# EAGLE board Schmatic (EAGLE 9.5.0)
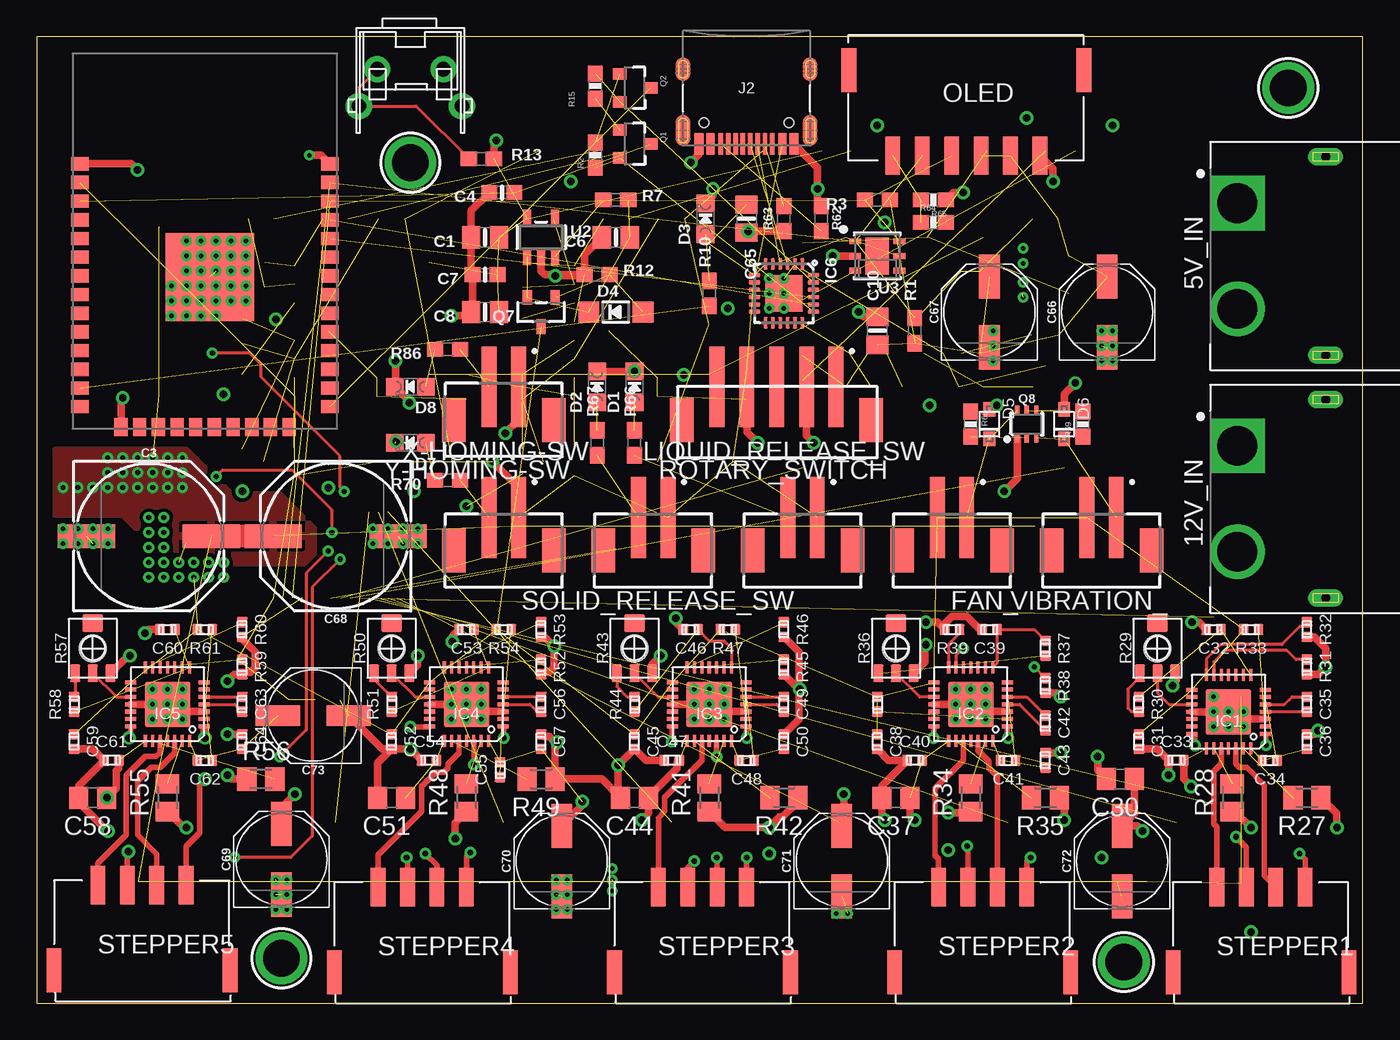
[diagram p2: board, top side]
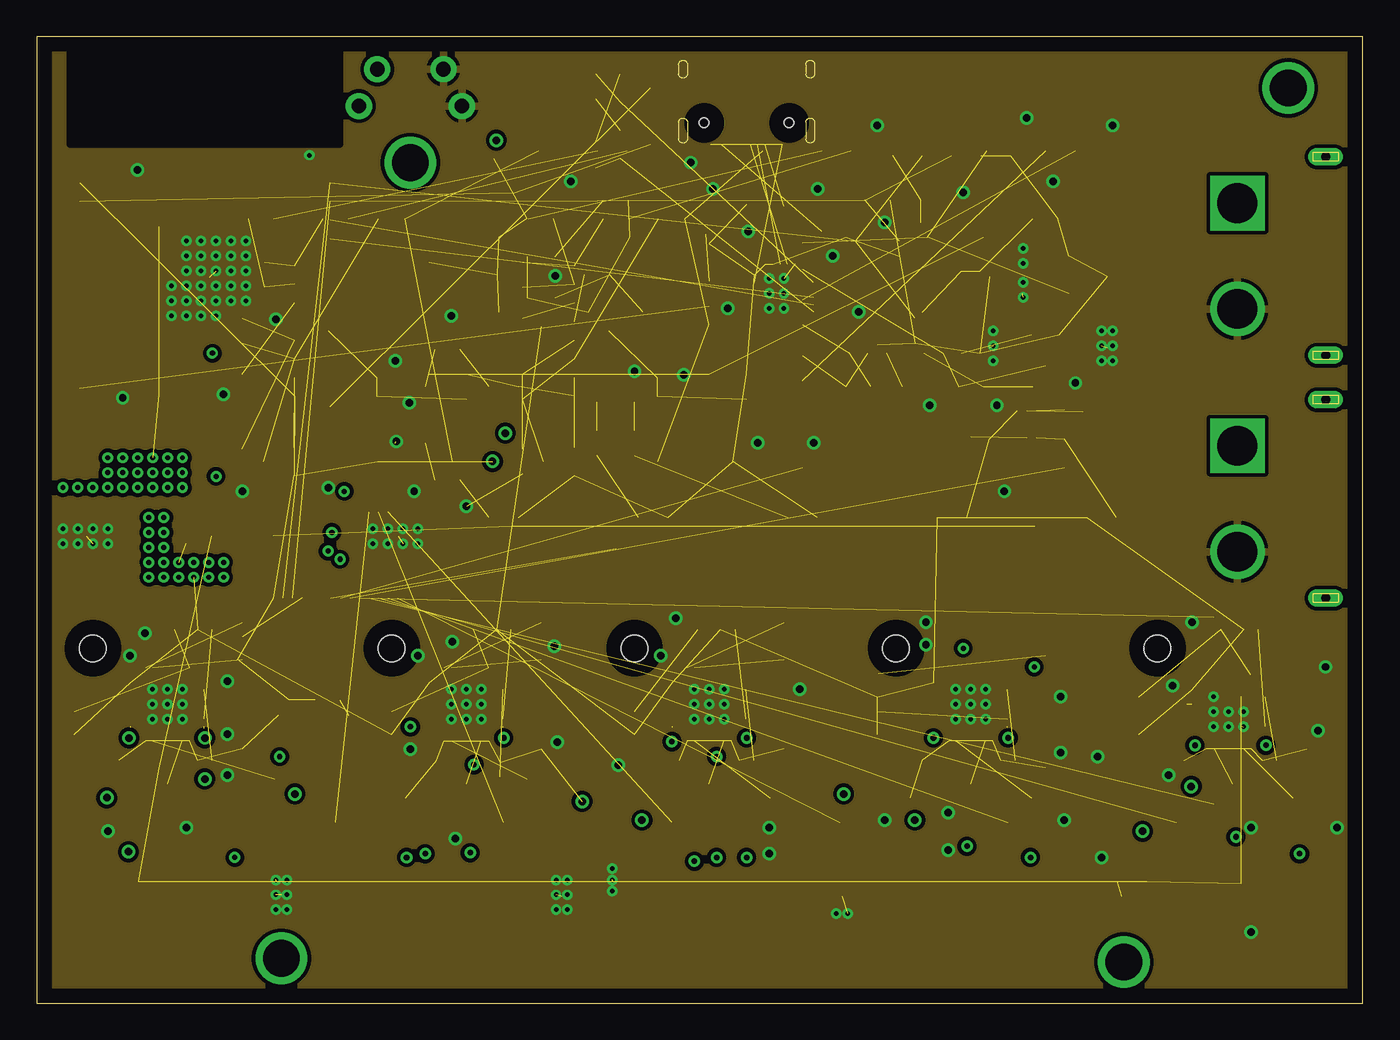
[diagram p3: board, inner layer GND]
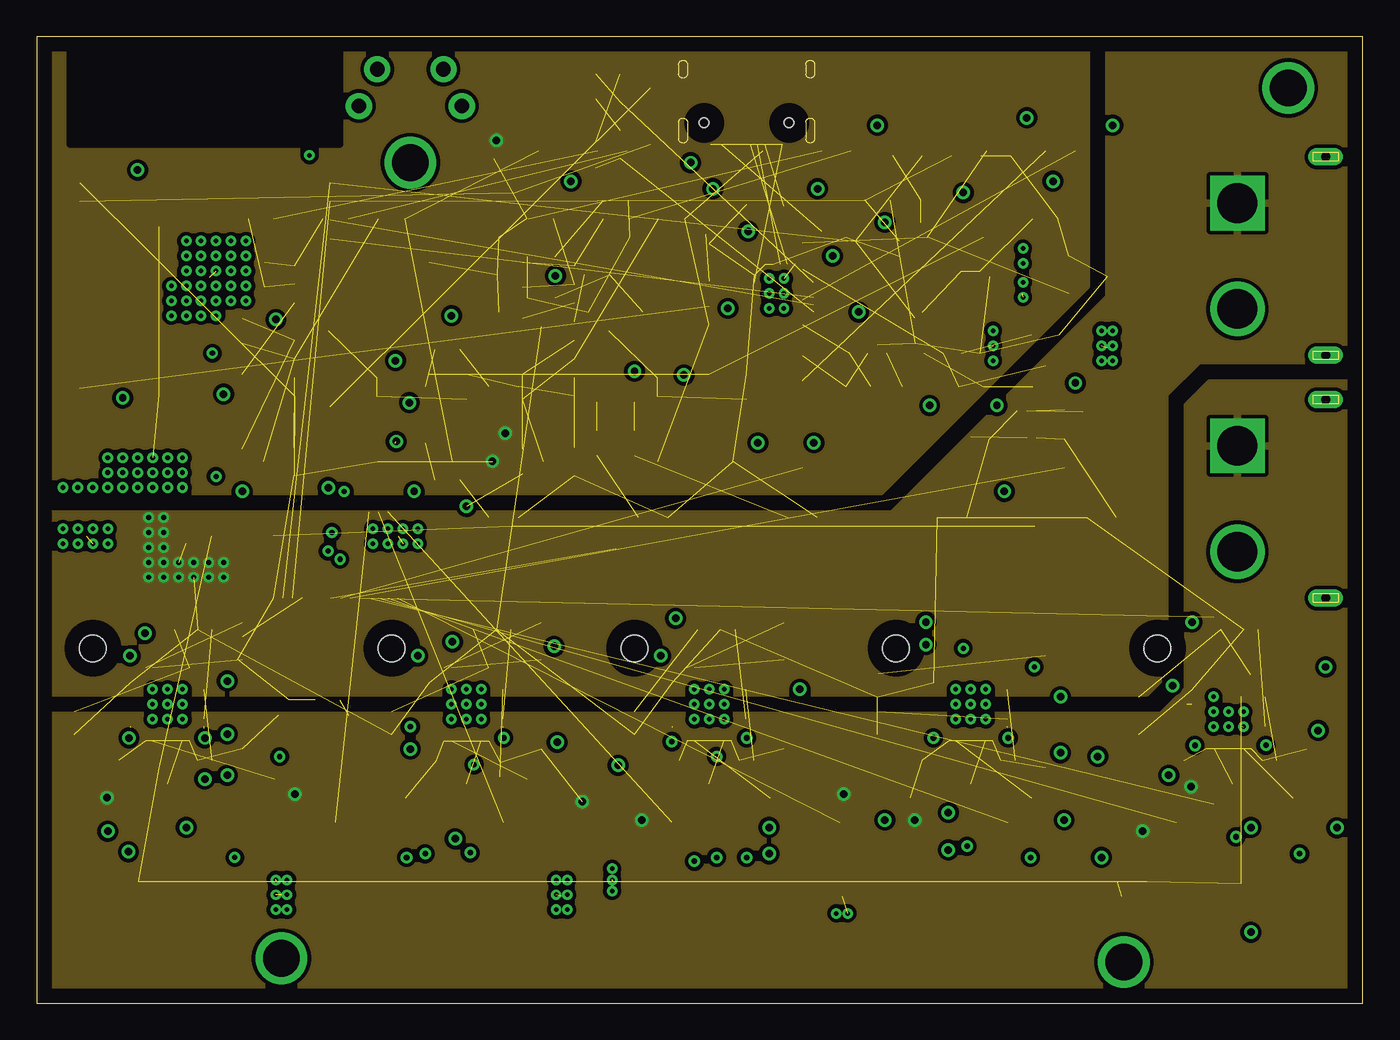
[diagram p4: board, inner layer Vref]
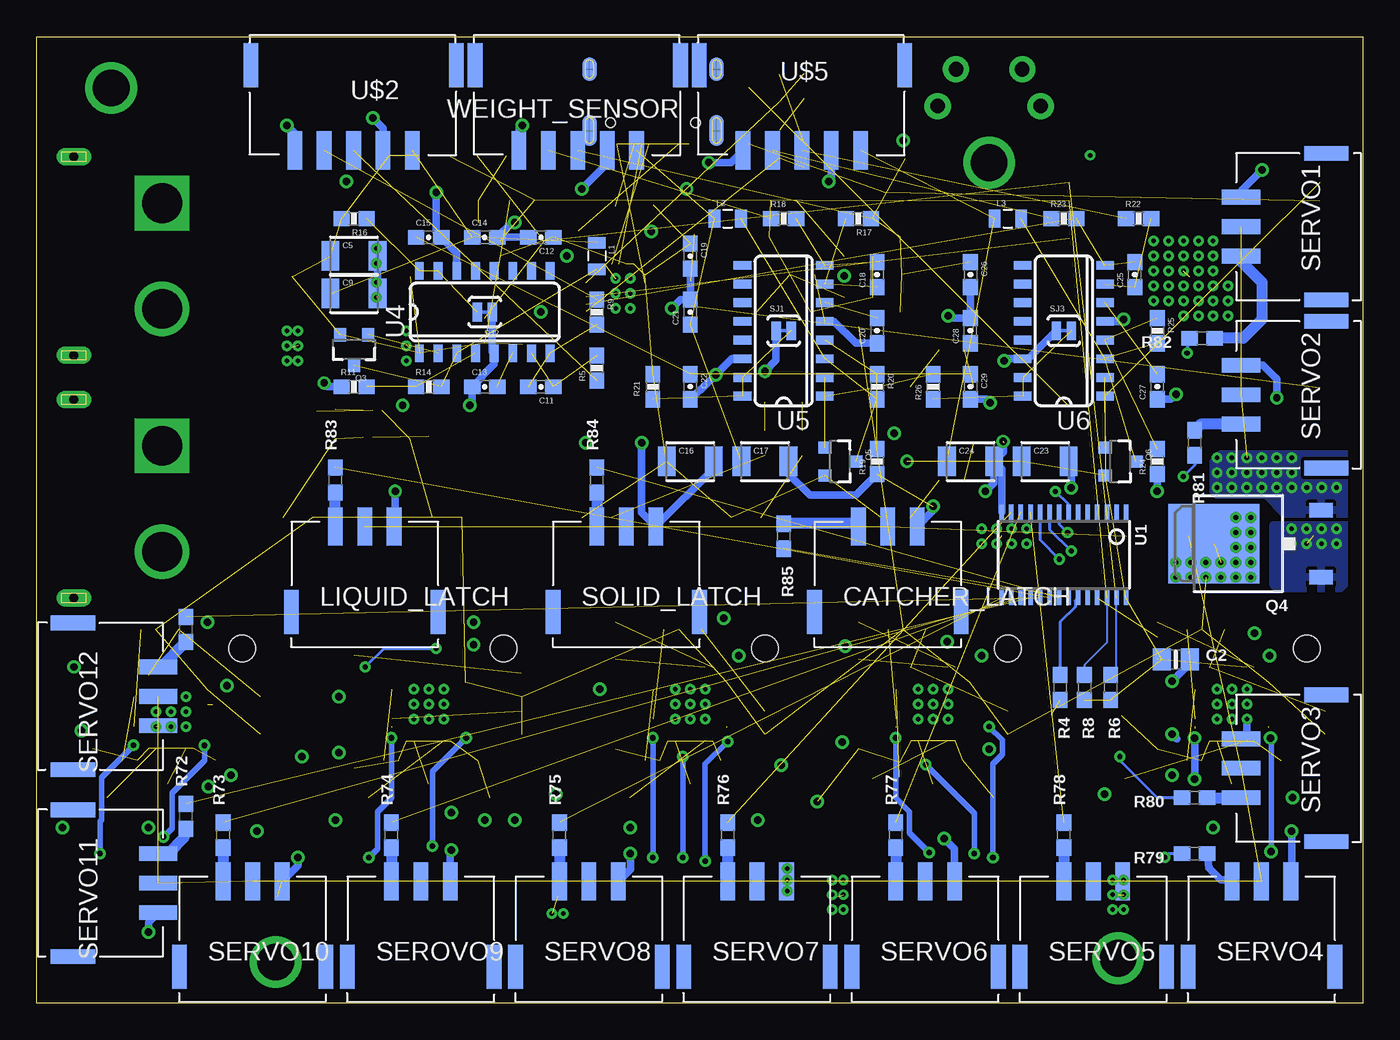
[diagram p5: board, bottom side, seen from below]

Size 90.15 x 65.71 mm. Coordinates in mm from the lower left corner, seen from the top.
Outline: 0,0 90.15,0 90.15,65.71 0,65.71 0,0
Copper layers (1+2*15+16): Top 0.035mm / dielectric 1.5mm / GND 0.035mm / dielectric 0.15mm / Vref 0.035mm / dielectric 0.2mm / Bottom 0.035mm
Design rules "default *": minimum track width 6mil, minimum drill 0.35mm, track to track 6mil, track to pad 6mil, pad to pad 6mil, via to via 6mil, smd to smd 6mil, copper to edge 40mil, drill to drill 6mil, minimum pad ring 10mil, minimum via ring 8mil, stop-mask expansion 4mil, vias tented up to drill 0mil, thermal gap 10mil
Net classes: 0 default: width 0.203 mm, drill 0.203 mm, clearance 0.203 mm; 1 sig: width 0.305 mm, drill 0.305 mm, clearance 0.254 mm; 2 Power: width 0.508 mm, drill 0.508 mm, clearance 0.254 mm; 3 HighSpeedSig: width 0.152 mm, drill 0.152 mm, clearance 0.254 mm; 4 StepperOut: width 0.381 mm, drill 0.381 mm, clearance 0.254 mm; 5 LowPower: width 0.305 mm, drill 0.305 mm, clearance 0.254 mm

## Footprints (pad centres in the part's own frame; a part is rotated, then mirrored left to right if it is on the bottom)
AMASS_XT60PW-M = drill 2.7 square: 1 -3.6,-6 | drill 2.7: 2 3.6,-6 | drill 0.6 pad 1.2 long: S1 -6.75,0; S2 6.75,0
0805-NO = smd 1.24 x 1.5: 1 -0.95,0; 2 0.95,0
PANASONIC_G = smd 3.9 x 1.6: + 4.25,0; - -4.25,0
0603-NO = smd 1.075 x 1: 1 -0.85,0; 2 0.85,0
1210 = smd 1.2 x 2: 1 -1.6,0; 2 1.6,0
0603-CAP = smd 1.1 x 1: 1 -0.85,0; 2 0.85,0
C0805 = smd 1.3 x 1.5: 1 -0.95,0; 2 0.95,0
C0402 = smd 0.75 x 0.7: 1 0,0.5; 2 0,-0.5
PANASONIC_D = smd 3 x 1.4: + 2.4,0; - -2.4,0
S3B-PH-SM4_TB = smd 1 x 2.6: 1 3.81,8.28; 2 5.81,8.28; 3 7.81,8.28 | smd 1 x 3: GND 0.826,2.48; GND2 10.794,2.48
CHIPLED_0805_NOOUTLINE = smd 1.2 x 1.2: A 0,-1.05; C 0,1.05
SOD-123 = smd 1.4 x 1.4: A 1.85,0; C -1.85,0
SOD-323F = smd 1 x 0.8: A -1,0; C 1,0
JST_B2B-PH-SM4-TB(LF)(SN) = smd 1 x 5.5: 1 -1,0; 2 1,0 | smd 1.6 x 3: 3 -3.4,2.25; 4 3.4,2.25
QFN28-PAD = smd 0.8 x 0.26: 1 -2.5,1.5; 2 -2.5,1; 3 -2.5,0.5; 4 -2.5,0; 5 -2.5,-0.5; 6 -2.5,-1; 7 -2.5,-1.5; 15 2.5,-1.5; 16 2.5,-1; 17 2.5,-0.5; 18 2.5,0; 19 2.5,0.5; 20 2.5,1; 21 2.5,1.5 | smd 0.26 x 0.8: 8 -1.5,-2.5; 9 -1,-2.5; 10 -0.5,-2.5; 11 0,-2.5; 12 0.5,-2.5; 13 1,-2.5; 14 1.5,-2.5; 22 1.5,2.5; 23 1,2.5; 24 0.5,2.5; 25 0,2.5; 26 -0.5,2.5; 27 -1,2.5; 28 -1.5,2.5 | smd 3.1 x 3.1: TP 0,0
QFN24_4MM_SMSC = smd 0.8 x 0.28: 1 -2,1.25; 2 -2,0.75; 3 -2,0.25; 4 -2,-0.25; 5 -2,-0.75; 6 -2,-1.25; 13 2,-1.25; 14 2,-0.75; 15 2,-0.25; 16 2,0.25; 17 2,0.75; 18 2,1.25 | smd 0.28 x 0.8: 7 -1.25,-2; 8 -0.75,-2; 9 -0.25,-2; 10 0.25,-2; 11 0.75,-2; 12 1.25,-2; 19 1.25,2; 20 0.75,2; 21 0.25,2; 22 -0.25,2; 23 -0.75,2; 24 -1.25,2 | smd 2.5 x 2.5: THERM 0,0
USB-C-16P = smd 0.3 x 1.45: A5 -1.25,0; A6 -0.25,0; A7 0.25,0; A8 1.25,0; B5 1.75,0; B6 0.75,0; B7 -0.75,0; B8 -1.75,0 | smd 0.6 x 1.45: GND -3.225,0; GND2 3.225,0 | smd 1 x 2.1: SHLD1 -4.32,-0.915; SHLD2 4.32,-0.915 | smd 1 x 2.1 bottom: SHLD3 -4.32,-0.915; SHLD4 4.32,-0.915 | smd 1 x 1.6: SHLD5 -4.32,-5.095; SHLD8 4.32,-5.095 | smd 1 x 1.6 bottom: SHLD6 -4.32,-5.095; SHLD7 4.32,-5.095 | smd 0.55 x 1.45: VBUS1 -2.45,0; VBUS2 2.45,0 | hole 0.65: -2.89,-1.445; 2.89,-1.445
0805 = smd 0.8 x 1.2: 1 -0.9,0; 2 0.9,0
S6B-PH-SM4_TB = smd 1 x 2.6: 1 5.46,9.68; 2 7.46,9.68; 3 9.46,9.68; 4 11.46,9.68; 5 13.46,9.68; 6 15.46,9.68 | smd 1 x 3: GND 2.476,3.88; GND2 18.444,3.88
SOT23-3 = smd 0.8 x 0.9: 1 -0.95,-1; 2 0.95,-1; 3 0,1.1
TO252 = smd 1 x 1.6: 1 -2.28,-4.8; 2 2.28,-4.8 | smd 5.4 x 6.2: 3 0,2.5
SOT23-R = smd 0.635 x 1.016: 1 -0.95,-1; 2 0.95,-1; 3 0,1
SC70-6 = smd 0.3 x 0.66: 1 -0.65,-0.92; 2 0,-0.92; 3 0.65,-0.92; 4 0.65,0.92; 5 0,0.92; 6 -0.65,0.92
0603 = smd 1.1 x 1: 1 -0.85,0; 2 0.85,0
0603-RES = smd 1.1 x 1: 1 -0.85,0; 2 0.85,0
0603-NO@1 = smd 1.1 x 1: 1 -0.85,0; 2 0.85,0
M0805 = smd 1.3 x 1.6: 1 -0.95,0; 2 0.95,0
POT_EVM3R = smd 0.7 x 1.2: 1 -1.2,-1.7; 2 0,-1.7; 3 1.2,-1.7 | smd 1.4 x 1.2: MOUNT 0,1.7 | hole 1.8: 0,0
JST_B5B-PH-SM4-TB = smd 1 x 5.5: 1 4.08,3.81; 2 6.08,3.81; 5 8.112,3.81; 6 10.144,3.81; 7 12.176,3.81 | smd 1.6 x 3: 3 1.68,6.06; 4 14.576,6.06
PAD-JUMPER-2-NC_BY_TRACE_YES_SILK = smd 0.635 x 1.27: 1 -0.508,0; 2 0.508,0
S4B-PH-SM4_TB = smd 1 x 2.6: 1 3.27,7.9; 2 5.27,7.9; 3 7.27,7.9; 4 9.27,7.9 | smd 1 x 3: GND 0.286,2.1; GND2 12.254,2.1
TSSOP28 = smd 0.305 x 0.991: 1 -4.225,-2.918; 2 -3.575,-2.918; 3 -2.925,-2.918; 4 -2.275,-2.918; 5 -1.625,-2.918; 6 -0.975,-2.918; 7 -0.325,-2.918; 8 0.325,-2.918; 9 0.975,-2.918; 10 1.625,-2.918; 11 2.275,-2.918; 12 2.925,-2.918; 13 3.575,-2.918; 14 4.225,-2.918; 15 4.225,2.918; 16 3.575,2.918; 17 2.925,2.918; 18 2.275,2.918; 19 1.625,2.918; 20 0.975,2.918; 21 0.325,2.918; 22 -0.325,2.918; 23 -0.975,2.918; 24 -1.625,2.918; 25 -2.275,2.918; 26 -2.925,2.918; 27 -3.575,2.918; 28 -4.225,2.918
SOT23-5 = smd 0.55 x 1.2: 1 -0.95,-1.3; 2 0,-1.3; 3 0.95,-1.3; 4 0.95,1.3; 5 -0.95,1.3
HTU21DF = smd 0.8 x 0.4: 1 -1.5,1; 2 -1.5,0; 3 -1.5,-1; 4 1.5,-1; 5 1.5,0; 6 1.5,1 | smd 1.6 x 2.5: PAD 0,0
SO16 = smd 0.6 x 1.2: 1 -4.445,-2.8; 2 -3.175,-2.8; 3 -1.905,-2.8; 4 -0.635,-2.8; 5 0.635,-2.8; 6 1.905,-2.8; 7 3.175,-2.8; 8 4.445,-2.8; 9 4.445,2.8; 10 3.175,2.8; 11 1.905,2.8; 12 0.635,2.8; 13 -0.635,2.8; 14 -1.905,2.8; 15 -3.175,2.8; 16 -4.445,2.8
S5B-PH-SM4_TB = smd 1 x 2.6: 1 4.92,9.33; 2 6.92,9.33; 3 8.92,9.33; 4 10.92,9.33; 5 12.92,9.33 | smd 1 x 3: GND 1.936,3.53; GND2 15.904,3.53
MOUNTINGHOLE_2.5_PLATED = drill 2.5 pad 3.2: P$1 0,0
RIGHT_ANGLE_TACTILE_SWITCH = drill 1 pad 1.778: B_L -2.25,0; B_R 2.25,0; T_L -3.5,2.5; T_R 3.5,2.5
WROOM32_SKINNY = smd 1.2 x 0.9: 1 -8.5,5; 2 -8.5,3.73; 3 -8.5,2.46; 4 -8.5,1.19; 5 -8.5,-0.08; 6 -8.5,-1.35; 7 -8.5,-2.62; 8 -8.5,-3.89; 9 -8.5,-5.16; 10 -8.5,-6.43; 11 -8.5,-7.7; 12 -8.5,-8.97; 13 -8.5,-10.24; 14 -8.5,-11.51; 25 8.5,-11.51; 26 8.5,-10.24; 27 8.5,-8.97; 28 8.5,-7.7; 29 8.5,-6.43; 30 8.5,-5.16; 31 8.5,-3.89; 32 8.5,-2.62; 33 8.5,-1.35; 34 8.5,-0.08; 35 8.5,1.19; 36 8.5,2.46; 37 8.5,3.73; 38 8.5,5 | smd 0.9 x 1.2: 15 -5.7,-12.9; 16 -4.43,-12.9; 17 -3.16,-12.9; 18 -1.89,-12.9; 19 -0.62,-12.9; 20 0.65,-12.9; 21 1.92,-12.9; 22 3.19,-12.9; 23 4.46,-12.9; 24 5.73,-12.9 | smd 6 x 6: P$1 0.34,-2.7

## Placement (x,y rotation side)
5V_IN  XT60PW-M  [AMASS_XT60PW-M]  87.63,50.8 270 top
12V_IN  XT60PW-M  [AMASS_XT60PW-M]  87.63,34.29 270 top
C1  10uF  [0805-NO]  30.48,52.07 180 top
C2  10uF  [0805-NO]  12.7,23.37 0 bottom
C3  560uF  [PANASONIC_G]  7.62,31.75 0 top
C4  1uF  [0603-NO]  31.62,55.12 180 top
C5  10uF  [1210]  68.58,50.8 0 bottom
C6  10µF  [0805-NO]  39.37,52.07 180 top
C7  1uF  [0603-NO]  30.48,49.53 180 top
C8  10µF  [0805-NO]  30.48,46.99 180 top
C9  10uF  [1210]  68.58,48.26 0 bottom
C10  0.1uF  [0805-NO]  57.15,45.72 90 top
C11  0.1uF  [0603-CAP]  55.88,41.91 180 bottom
C12  0.1uF  [0603-CAP]  55.88,52.07 180 bottom
C13  0.1uF  [0603-CAP]  59.69,41.91 0 bottom
C14  0.1uF  [0603-CAP]  59.69,52.07 0 bottom
C15  0.1uF  [0603-CAP]  63.5,52.07 0 bottom
C16  10uF  [1210]  45.72,36.83 0 bottom
C17  10uF  [1210]  40.64,36.83 0 bottom
C18  0.1uF  [0603-CAP]  33.02,49.53 90 bottom
C19  0.1uF  [0603-CAP]  45.72,50.8 270 bottom
C20  0.1uF  [0603-CAP]  33.02,45.72 90 bottom
C21  0.1uF  [0603-CAP]  45.72,46.99 90 bottom
C22  0.1uF  [0603-CAP]  45.72,41.91 270 bottom
C23  10uF  [1210]  21.59,36.83 0 bottom
C24  10uF  [1210]  26.67,36.83 0 bottom
C25  0.1uF  [0603-CAP]  15.49,49.53 90 bottom
C26  0.1uF  [0603-CAP]  26.67,49.53 270 bottom
C27  0.1uF  [0603-CAP]  13.97,41.91 90 bottom
C28  0.1uF  [0603-CAP]  26.67,45.72 90 bottom
C29  0.1uF  [0603-CAP]  26.67,41.91 270 bottom
C30  1u/50V  [C0805]  73.66,15.24 180 top
C31  100n/50V  [C0402]  74.93,17.78 180 top
C32  4u7/6V3  [C0402]  80.01,25.4 90 top
C33  100n/50V  [C0402]  77.47,16.51 270 top
C34  100n/50V  [C0402]  83.82,16.51 90 top
C35  22n/50V  [C0402]  86.36,20.32 180 top
C36  100n/50V  [C0402]  86.36,17.78 180 top
C37  1u/50V  [C0805]  58.42,13.97 180 top
C38  100n/50V  [C0402]  57.15,17.78 180 top
C39  4u7/6V3  [C0402]  64.77,25.4 90 top
C40  100n/50V  [C0402]  59.69,16.51 270 top
C41  100n/50V  [C0402]  66.04,16.51 90 top
C42  22n/50V  [C0402]  68.58,19.05 180 top
C43  100n/50V  [C0402]  68.58,16.51 180 top
C44  1u/50V  [C0805]  40.64,13.97 180 top
C45  100n/50V  [C0402]  40.64,17.78 180 top
C46  4u7/6V3  [C0402]  44.45,25.4 90 top
C47  100n/50V  [C0402]  43.18,16.51 270 top
C48  100n/50V  [C0402]  48.26,16.51 90 top
C49  22n/50V  [C0402]  50.8,20.32 180 top
C50  100n/50V  [C0402]  50.8,17.78 180 top
C51  1u/50V  [C0805]  24.13,13.97 180 top
C52  100n/50V  [C0402]  24.13,17.78 180 top
C53  4u7/6V3  [C0402]  29.21,25.4 90 top
C54  100n/50V  [C0402]  26.67,16.51 270 top
C55  100n/50V  [C0402]  31.5,15.88 0 top
C56  22n/50V  [C0402]  34.29,20.32 180 top
C57  100n/50V  [C0402]  34.29,17.78 180 top
C58  1u/50V  [C0805]  3.81,13.97 180 top
C59  100n/50V  [C0402]  2.54,17.78 180 top
C60  4u7/6V3  [C0402]  8.89,25.4 90 top
C61  100n/50V  [C0402]  5.08,16.51 270 top
C62  100n/50V  [C0402]  11.43,16.51 90 top
C63  22n/50V  [C0402]  13.97,20.32 180 top
C64  100n/50V  [C0402]  13.97,17.78 180 top
C65  10uF  [0805-NO]  48.26,53.34 270 top
C66  100uF  [PANASONIC_D]  72.77,46.99 90 top
C67  100uF  [PANASONIC_D]  64.77,46.99 90 top
C68  560uF  [PANASONIC_G]  20.32,31.75 180 top
C69  100uF  [PANASONIC_D]  16.64,9.78 90 top
C70  100uF  [PANASONIC_D]  35.69,9.65 90 top
C71  100uF  [PANASONIC_D]  54.74,9.65 90 top
C72  100uF  [PANASONIC_D]  73.79,9.65 90 top
C73  100uF  [PANASONIC_D]  18.8,19.56 180 top
CATCHER_LATCH  S3B-PH-SM4_TB  [S3B-PH-SM4_TB]  38.1,24.13 0 bottom
D1  RED  [CHIPLED_0805_NOOUTLINE]  40.64,41.91 0 top
D2  RED  [CHIPLED_0805_NOOUTLINE]  38.1,41.91 0 top
D3  RED  [CHIPLED_0805_NOOUTLINE]  45.47,53.34 0 top
D4  MBR120  [SOD-123]  39.37,46.99 0 top
D5  [SOD-323F]  64.77,39.37 270 top
D6  [SOD-323F]  69.85,39.37 270 top
D7  RED  [CHIPLED_0805_NOOUTLINE]  25.4,38.1 90 top
D8  RED  [CHIPLED_0805_NOOUTLINE]  25.4,41.91 90 top
FAN_  B2B-PH-SM4-TB(LF)(SN)  [JST_B2B-PH-SM4-TB(LF)(SN)]  62.23,33.02 180 top
IC1  TMC2208  [QFN28-PAD]  81.03,19.81 180 top
IC2  TMC2208  [QFN28-PAD]  63.5,20.32 180 top
IC3  TMC2208  [QFN28-PAD]  45.72,20.32 180 top
IC4  TMC2208  [QFN28-PAD]  29.21,20.32 180 top
IC5  TMC2208  [QFN28-PAD]  8.89,20.32 180 top
IC6  CP2104  [QFN24_4MM_SMSC]  50.8,48.26 270 top
J2  [USB-C-16P]  48.26,58.42 180 top
L1  3.3uH  [0805]  52.07,50.8 270 bottom
L2  3.3uH  [0805]  43.18,53.34 0 bottom
L3  3.3uH  [0805]  24.13,53.34 0 bottom
LIQUID_LATCH  S3B-PH-SM4_TB  [S3B-PH-SM4_TB]  73.66,24.13 0 bottom
LIQUID_RELEASE_SW  B2B-PH-SM4-TB(LF)(SN)  [JST_B2B-PH-SM4-TB(LF)(SN)]  52.07,33.02 180 top
OLED  S6B-PH-SM4_TB  [S6B-PH-SM4_TB]  73.66,67.31 180 top
Q1  mmbt2222  [SOT23-3]  40.64,58.42 270 top
Q2  mmbt2222  [SOT23-3]  40.64,62.23 270 top
Q3  MMBT4403  [SOT23-3]  68.58,44.45 180 bottom
Q4  AOD417  [TO252]  7.62,31.24 90 bottom
Q5  MMBT4403  [SOT23-3]  35.56,36.83 270 bottom
Q6  MMBT4403  [SOT23-3]  16.51,36.83 270 bottom
Q7  DMG3415U  [SOT23-R]  34.29,46.99 180 top
Q8  [SC70-6]  67.31,39.37 0 top
R1  10k  [0603]  59.69,45.72 90 top
R2  10K  [0603-RES]  37.97,57.66 90 top
R3  10k  [0603]  57.15,54.61 180 top
R4  10k  [0603]  20.57,21.46 270 bottom
R5  100  [0603-RES]  52.07,43.18 90 bottom
R6  10k  [0603]  17.14,21.46 270 bottom
R7  100K  [0603-NO@1]  39.37,54.61 0 top
R8  10k  [0603]  18.92,21.46 270 bottom
R9  100  [0603-RES]  52.07,46.99 270 bottom
R10  1K  [0603-NO@1]  45.72,48.26 90 top
R11  8.2K  [0603-RES]  68.58,41.91 0 bottom
R12  100K  [0603-NO@1]  38.1,49.53 0 top
R13  10k  [0603]  30.23,57.4 0 top
R14  20k  [0603-RES]  63.5,41.91 0 bottom
R15  10K  [0603-RES]  37.97,62.36 270 top
R16  10K  [0603-RES]  68.58,53.34 180 bottom
R17  100  [0603-RES]  34.29,53.34 180 bottom
R18  100  [0603-RES]  39.37,53.34 0 bottom
R19  8.2K  [0603-RES]  33.02,36.83 90 bottom
R20  20k  [0603-RES]  33.02,41.91 270 bottom
R21  10K  [0603-RES]  48.26,41.91 90 bottom
R22  100  [0603-RES]  15.24,53.34 0 bottom
R23  100  [0603-RES]  20.32,53.34 0 bottom
R24  8.2K  [0603-RES]  13.97,36.83 90 bottom
R25  20k  [0603-RES]  13.97,45.72 270 bottom
R26  10K  [0603-RES]  29.21,41.91 90 bottom
R27  R0805/0R11  [M0805]  86.36,13.97 180 top
R28  R0805/0R11  [M0805]  81.28,13.97 90 top
R29  20k  [POT_EVM3R]  76.2,24.13 0 top
R30  20k  [C0402]  74.93,20.32 180 top
R31  20k  [C0402]  86.36,22.86 180 top
R32  20k  [C0402]  86.36,25.4 180 top
R33  20k  [C0402]  82.55,25.4 90 top
R34  R0805/0R11  [M0805]  63.5,13.97 90 top
R35  R0805/0R11  [M0805]  68.58,13.97 180 top
R36  20k  [POT_EVM3R]  58.42,24.13 0 top
R37  20k  [C0402]  68.58,24.13 180 top
R38  20k  [C0402]  68.58,21.59 180 top
R39  20k  [C0402]  62.23,25.4 90 top
R40  20k  [C0402]  57.15,20.32 0 top
R41  R0805/0R11  [M0805]  45.72,13.97 90 top
R42  R0805/0R11  [M0805]  50.8,13.97 180 top
R43  20k  [POT_EVM3R]  40.64,24.13 0 top
R44  20k  [C0402]  40.64,20.32 0 top
R45  20k  [C0402]  50.8,22.86 180 top
R46  20k  [C0402]  50.8,25.4 180 top
R47  20k  [C0402]  46.99,25.4 90 top
R48  R0805/0R11  [M0805]  29.21,13.97 90 top
R49  R0805/0R11  [M0805]  34.29,15.24 180 top
R50  20k  [POT_EVM3R]  24.13,24.13 0 top
R51  20k  [C0402]  24.13,20.32 0 top
R52  20k  [C0402]  34.29,22.86 180 top
R53  20k  [C0402]  34.29,25.4 180 top
R54  20k  [C0402]  31.75,25.4 90 top
R55  R0805/0R11  [M0805]  8.89,13.97 90 top
R56  R0805/0R11  [M0805]  15.24,15.24 0 top
R57  20k  [POT_EVM3R]  3.81,24.13 0 top
R58  20k  [C0402]  2.54,20.32 0 top
R59  20k  [C0402]  13.97,22.86 180 top
R60  20k  [C0402]  13.97,25.4 180 top
R61  20k  [C0402]  11.43,25.4 90 top
R62  5.1k  [0603]  53.34,53.34 270 top
R63  5.1k  [0603]  50.8,53.34 90 top
R64  10K  [0603-RES]  60.96,53.09 0 top
R65  10K  [0603-RES]  60.96,54.61 180 top
R66  1K  [0603-NO@1]  40.64,38.1 90 top
R67  1K  [0603-NO@1]  38.1,38.1 90 top
R68  10K  [0603-RES]  63.5,39.37 270 top
R69  10K  [0603-RES]  71.12,39.37 90 top
R70  1K  [0603-NO@1]  27.94,35.56 180 top
R71  22  [0603]  80.01,25.4 90 bottom
R72  22  [0603]  80.01,12.7 90 bottom
R73  22  [0603]  77.47,11.43 90 bottom
R74  22  [0603]  66.04,11.43 90 bottom
R75  22  [0603]  54.61,11.43 90 bottom
R76  22  [0603]  43.18,11.43 90 bottom
R77  22  [0603]  31.75,11.43 90 bottom
R78  22  [0603]  20.32,11.43 90 bottom
R79  22  [0603]  11.43,10.16 180 bottom
R80  22  [0603]  11.43,13.97 180 bottom
R81  22  [0603]  11.43,38.1 270 bottom
R82  22  [0603]  10.92,45.21 180 bottom
R83  22  [0603]  69.85,35.56 90 bottom
R84  22  [0603]  52.07,35.56 90 bottom
R85  22  [0603]  39.37,31.75 270 bottom
R86  1K  [0603-NO@1]  27.94,44.45 180 top
ROTARY_SWITCH  B5B-PH-SM4-TB  [JST_B5B-PH-SM4-TB]  58.42,45.72 180 top
SEROVO9  S3B-PH-SM4_TB  [S3B-PH-SM4_TB]  69.85,0 0 bottom
SERVO1  S3B-PH-SM4_TB  [S3B-PH-SM4_TB]  0,46.99 90 bottom
SERVO2  S3B-PH-SM4_TB  [S3B-PH-SM4_TB]  0,35.56 90 bottom
SERVO3  S3B-PH-SM4_TB  [S3B-PH-SM4_TB]  0,10.16 90 bottom
SERVO4  S3B-PH-SM4_TB  [S3B-PH-SM4_TB]  12.7,0 0 bottom
SERVO5  S3B-PH-SM4_TB  [S3B-PH-SM4_TB]  24.13,0 0 bottom
SERVO6  S3B-PH-SM4_TB  [S3B-PH-SM4_TB]  35.56,0 0 bottom
SERVO7  S3B-PH-SM4_TB  [S3B-PH-SM4_TB]  46.99,0 0 bottom
SERVO8  S3B-PH-SM4_TB  [S3B-PH-SM4_TB]  58.42,0 0 bottom
SERVO10  S3B-PH-SM4_TB  [S3B-PH-SM4_TB]  81.28,0 0 bottom
SERVO11  S3B-PH-SM4_TB  [S3B-PH-SM4_TB]  90.17,13.97 270 bottom
SERVO12  S3B-PH-SM4_TB  [S3B-PH-SM4_TB]  90.17,26.67 270 bottom
SJ1  [PAD-JUMPER-2-NC_BY_TRACE_YES_SILK]  39.37,45.72 0 bottom
SJ2  [PAD-JUMPER-2-NC_BY_TRACE_YES_SILK]  59.69,46.99 180 bottom
SJ3  [PAD-JUMPER-2-NC_BY_TRACE_YES_SILK]  20.32,45.72 0 bottom
SOLID_LATCH  S3B-PH-SM4_TB  [S3B-PH-SM4_TB]  55.88,24.13 0 bottom
SOLID_RELEASE_SW  B2B-PH-SM4-TB(LF)(SN)  [JST_B2B-PH-SM4-TB(LF)(SN)]  41.91,33.02 180 top
STEPPER1  S4B-PH-SM4_TB  [S4B-PH-SM4_TB]  76.96,0 0 top
STEPPER2  S4B-PH-SM4_TB  [S4B-PH-SM4_TB]  58.04,0 0 top
STEPPER3  S4B-PH-SM4_TB  [S4B-PH-SM4_TB]  38.99,0 0 top
STEPPER4  S4B-PH-SM4_TB  [S4B-PH-SM4_TB]  19.94,0 0 top
STEPPER5  S4B-PH-SM4_TB  [S4B-PH-SM4_TB]  0.89,0.13 0 top
U1  PCA9685  [TSSOP28]  20.32,30.48 180 bottom
U2  AP2112-3.3  [SOT23-5]  34.29,52.07 0 top
U3  HTU21DF  [HTU21DF]  57.15,50.8 180 top
U4  HX711  [SO16]  59.69,46.99 0 bottom
U5  HX711  [SO16]  39.37,45.72 90 bottom
U6  HX711  [SO16]  20.32,45.72 90 bottom
U$2  S5B-PH-SM4_TB  [S5B-PH-SM4_TB]  59.69,67.31 180 bottom
U$4  MOUNTINGHOLE2.5  [MOUNTINGHOLE_2.5_PLATED]  16.64,3.05 0 top
U$5  S5B-PH-SM4_TB  [S5B-PH-SM4_TB]  29.21,67.31 180 bottom
U$9  RIGHT_ANGLE_TACTILE_SWITCH  [RIGHT_ANGLE_TACTILE_SWITCH]  25.4,63.5 180 top
U$48  MOUNTINGHOLE2.5  [MOUNTINGHOLE_2.5_PLATED]  73.91,2.79 0 top
U$49  MOUNTINGHOLE2.5  [MOUNTINGHOLE_2.5_PLATED]  25.4,57.15 0 top
U$50  MOUNTINGHOLE2.5  [MOUNTINGHOLE_2.5_PLATED]  85.09,62.23 0 top
VIBRATION_  B2B-PH-SM4-TB(LF)(SN)  [JST_B2B-PH-SM4-TB(LF)(SN)]  72.39,33.02 180 top
WEIGHT_SENSOR  S5B-PH-SM4_TB  [S5B-PH-SM4_TB]  44.45,67.31 180 bottom
X2  ESP32_WROOM32_SKINNY  [WROOM32_SKINNY]  11.43,52.07 0 top
X-HOMING-SW  B2B-PH-SM4-TB(LF)(SN)  [JST_B2B-PH-SM4-TB(LF)(SN)]  31.75,33.02 180 top
Y-HOMING-SW  B2B-PH-SM4-TB(LF)(SN)  [JST_B2B-PH-SM4-TB(LF)(SN)]  31.75,41.91 180 top

## Tracks (layer width: path | path; a pad name or v marks a point on that pad's centre or on a via)
5V_REG  (via drill 0.33)  (19 unrouted)
  other vias: 7.62,33.02 7.62,32 7.62,30.99 7.62,29.97 7.62,28.96 8.64,28.96 9.65,28.96 10.67,28.96 11.68,28.96 12.7,28.96 12.7,29.97 11.68,29.97 10.67,29.97 9.65,29.97 8.64,29.97 8.64,30.99 8.64,32 8.64,33.02
  pour Vref: 0.25,21.08 74.68,21.08 75.18,21.08 75.44,21.08 76.71,22.35 76.71,28.45 76.71,41.4 78.99,43.69 90.17,43.69 90.17,65.53 72.9,65.53 72.9,48.01 58.17,33.27 0,33.27 0,21.34
5V_SERVO  (via drill 0.33)  (15 unrouted)
  Top 1.524: C3.+ C68.+
  other vias: 4.83,37.08 5.84,37.08 6.86,37.08 7.87,37.08 8.89,37.08 4.83,36.07 5.84,36.07 6.86,36.07 7.87,36.07 8.89,36.07 9.91,36.07 9.91,35.05 8.89,35.05 7.87,35.05 6.86,35.05 5.84,35.05 4.83,35.05 3.81,35.05 2.79,35.05 1.78,35.05 9.91,37.08
  pour Bottom: 1.02,33.27 5.33,33.27 6.6,34.54 9.91,34.54 10.16,34.8 10.16,36.83 9.65,37.34 0.76,37.34 0.76,33.53
  pour Top: 1.27,33.27 5.84,33.27 9.14,29.97 18.8,29.97 18.8,32.26 16.51,34.54 13.21,34.54 10.16,37.59 1.27,37.59
12V_REG  (via drill 0.51)  (24 unrouted)
  Top 0.508: C37.1 59.37,12.77 v59.69,12.45 | C30.1 74.61,12.88 C72.+ 74.82,12.05 v75.18,11.68 | C33.1 77.97,15.25 v78.49,14.73 | C71.+ 54.86,12.18 v54.86,14.22 | C70.+ 37.08,13.45 v37.08,13.72 | C47.1 43.54,16.37 43.54,15.97 41.59,14.02 C44.1 41.59,12.93 41.56,12.9 41.56,12.86 v41.15,12.45 | C69.+ 16.64,13.31 v17.55,14.22 | C58.1 5.4,14.61 5.4,15.78 5.58,15.97 C61.1
  other vias: 4.76,13.97
  pour Vref: 0,19.56 0,0.25 90.42,0.25 90.42,42.16 79.76,42.16 78.23,40.64 78.23,21.34 76.45,19.56
A+_1  (1 unrouted)
A+_2  (1 unrouted)
A+_3  (1 unrouted)
A-_1  (1 unrouted)
A-_2  (1 unrouted)
A-_3  (1 unrouted)
AVDD_1  (3 unrouted)
AVDD_2  (3 unrouted)
AVDD_3  (3 unrouted)
BRA  (1 unrouted)
BRA1  (1 unrouted)
BRA2  (1 unrouted)
BRA3  (1 unrouted)
BRA4  (1 unrouted)
BRB  (1 unrouted)
BRB1  (1 unrouted)
BRB2  (1 unrouted)
BRB3  (1 unrouted)
BRB4  (1 unrouted)
CC1  (1 unrouted)
CC2  (1 unrouted)
CLK_1
  Top 0.203: R31.2 85.61,23.36 84.99,23.98 80.77,23.98 80.01,23.22 80.01,22.33 IC1.13
CLK_2  (via drill 0.35)
  Top 0.203: R38.2 v67.82,22.85 v67.82,22.86 | v62.99,24.13 62.5,23.64 IC2.13
  Bottom 0.203: v67.82,22.86 66.55,24.13 v62.99,24.13
CLK_3  (1 unrouted)
CLK_4  (1 unrouted)
CLK_5  (1 unrouted)
CPI
  Top 0.203: IC1.5 84.83,20.31 85.34,20.83 C35.2
CPI1
  Top 0.203: IC2.5 67.31,20.82 C42.2
CPI2
  Top 0.203: IC3.5 C49.2
CPI3
  Top 0.203: C56.2 IC4.5
CPI4
  Top 0.203: IC5.5 C63.2
CPO
  Top 0.203: IC1.4 C35.1
CPO1
  Top 0.203: IC2.4 66.81,20.32 C42.1
CPO2
  Top 0.203: IC3.4 50.3,20.32 C49.1
CPO3
  Top 0.203: C56.1 34.03,19.82 33.53,20.32 IC4.4
CPO4
  Top 0.203: IC5.4 13.47,20.32 C63.1
DTR  (2 unrouted)
EN  (1 unrouted)
EN_1  (1 unrouted)
EN_2  (1 unrouted)
EN_3  (1 unrouted)
EN_4  (1 unrouted)
EN_5  (1 unrouted)
FAN_5V  (2 unrouted)
GND  (via drill 0.3, 0.51)  (20 unrouted)
  Top 0.508: v18.54,57.66 19.34,57.66 X2.38 | C60.1 7.62,25.4 v7.37,25.15 | R57.3 6.2,23.62 v6.35,23.62 | v28.45,11.18 28.45,12.26 R48.1 | C51.2 23.18,16.33 C52.1 | C54.2 v25.4,17.28 C52.1 | C73.- 23.47,17.28 C52.1 | 39.53,14.13 38.42,15.24 R49.1 35.24,17.73 | 39.53,14.13 C44.2 | 39.53,14.13 v39.53,16.17 C45.1 41.41,16.51 C47.2 | R41.1 46.8,11.94 v49.78,11.94 50.51,12.66 50.71,12.66 51.75,13.7 R42.1 | R34.1 63.43,12.95 v61.98,12.95 | v57.66,12.45 57.47,12.45 C37.2 57.47,14.79 C40.2 57.92,16.51 C38.1 | R35.1 69.85,13.65 v69.85,12.45 | C30.2 72.14,15.81 v72.14,16.76 | C31.1 76.2,17.28 C33.2 76.97,15.5 v76.96,15.49 | C43.2 69.59,17.01 v69.6,17.02 | R38.1 69.33,21.09 v69.6,20.83 | C32.1 79,25.91 v78.55,25.91 | R29.3 77.4,21.77 v77.22,21.59 | R31.1 87.13,22.36 v87.63,22.86 87.63,24.13 86.86,24.9 R32.1 | C36.2 86.86,18.28 v87.12,18.54 | R28.1 81.47,13.02 v82.55,11.94 | R27.1 88.39,12.89 v88.39,11.93 | C6.2 37.25,50.9 R12.1 | U2.2 34.29,49.78 34.54,49.53 R12.1 | R12.1 37.18,49.46 v35.26,49.46 | C4.2 29.53,53.88 C1.2 29.53,49.63 C7.2 29.63,47.09 C8.2 29.28,46.74 v28.19,46.74 | X2.15 5.73,41.04 v5.84,41.15 | X2.1 6.43,57.07 v6.86,56.64 | R36.3 60.38,23.19 60.38,24.31 v60.45,24.38 | v60.45,25.91 61.22,25.91 R39.1 61.73,25.8 62.21,26.28 63.25,26.28 64.13,25.4 C39.1 | R43.3 41.84,23.04 v42.42,23.62 | C46.1 43.43,25.92 v43.43,26.16 | R50.3 25.91,23.01 v25.91,23.62 | C53.1 28.27,24.96 v28.27,24.57 | R53.1 34.54,24.9 v35.17,24.26 35.17,22.84 34.83,22.5 34.43,22.5 R52.1 | C57.2 34.43,18.14 34.83,18.14 35.24,17.73 | 35.24,17.73 v35.38,17.73 | D6.A 69.85,41.4 v70.61,42.16 | C59.1 3.81,17.28 C61.2 2.86,14.79 C58.2 2.86,13.65 v4.83,11.68
  Top 0.508: v12.95,18.29 C64.2 | R56.1 13.21,15.24 v12.95,15.49 | R60.1 13.97,24.76 14.85,23.88 14.85,22.84 14.51,22.5 14.11,22.5 R59.1 13.41,22.36 v12.95,21.91 | v25.33,40.82 25.33,40.93 D8.C 24.38,41.94 v24.38,43.69 | C50.2 51.82,19.3 51.82,21.34 | 51.82,21.34 R45.1 | R46.1 51.82,23.88 51.82,21.34 | 51.82,21.34 v51.89,21.34 | R55.1 9.97,11.94 v10.16,11.94 | C10.2 56.2,46.67 v55.88,46.99 | ROTARY_SWITCH.2 52.34,38.59 v52.83,38.1 | ROTARY_SWITCH.6 48.28,38.85 v49.02,38.1 | R63.1 v48.36,52.49 C65.2 | D3.C 45.97,54.9 v45.97,55.37 | J2.GND2 45.03,57.73 v44.45,57.15 | R62.1 53.09,54.44 v53.09,55.37 53.09,56.82 J2.GND | OLED.1 69.09,56.74 v69.09,55.88 | R65.1 62.32,55.12 v62.99,55.12 | D5.A 65.04,40.64 v65.28,40.64 | D1.C D2.C | U3.5 v54.1,50.8 | Q8.1 66.66,35.67 v65.79,34.8 | IC5.18 v7.87,20.32 | IC4.18 IC4.TP 29.71,19.82 IC4.3 | IC3.18 IC3.TP 46.22,19.82 IC3.3 | IC2.18 IC2.TP 64,19.82 IC2.3 | IC1.18 IC1.TP 81.53,19.31 IC1.3 | IC5.3 9.39,19.82 IC5.TP
  Bottom 0.508: SERVO6.3 27.75,10.48 v28.45,11.18 | SERVO8.3 49.78,9.11 v49.78,10.16 | SEROVO9.3 62.04,10.35 v61.98,10.41 | SERVO10.3 72.39,9.36 v72.39,9.91 | v28.19,46.74 28.03,46.57 C28.2 C26.2 | SERVO2.3 6.79,43.37 5.84,42.42 v5.84,41.15 | v6.86,56.64 8.28,55.22 SERVO1.3 | SERVO11.3 82.55,5.5 v82.55,4.83 | R11.1 70.36,41.91 v70.61,42.16 | v4.83,11.68 4.83,8.34 SERVO4.3 | 12.64,17.97 v12.95,18.29 | C2.2 11.75,23.11 v12.95,21.91 | R24.1 v13.97,34.8 | C23.2 19.81,36.65 v19.81,35.05 | C24.2 24.44,37.46 v24.44,38.19 | v25.33,40.82 25.57,41.06 C29.2 | v24.38,43.69 24.26,43.81 U6.14 22.73,43.81 SJ3.1 | U6.5 16.38,46.35 v16.26,46.48 | U$5.5 42.96,57.15 v44.45,57.15 | U$5.2 36.13,56.07 v36.32,55.88 | WEIGHT_SENSOR.5 57.37,59.47 v57.15,59.69 | U$2.5 72.61,59.15 v73.15,59.69 | U$2.2 66.61,59.5 v67.31,60.2 | v62.99,55.12 62.99,52.41 C15.2 61.59,51.02 U4.14 | C5.2 C9.2 | SJ2.1 59.18,44.32 U4.5 59.05,43.46 59.9,42.62 59.9,42.55 C13.1 60.54,40.81 v60.71,40.64 | SJ1.1 39.88,43.72 D1.C | C22.2 45.08,41.7 45.01,41.7 v43.99,42.72 42.9,43.81 U5.14 | v46.99,47.24 46.39,47.84 C21.2 C19.2 | U5.5 35.94,46.35 34.46,44.87 C20.1 | C12.2 C14.2 57.82,53.09 v57.66,53.09 | v65.79,34.8 65.79,32.47 LIQUID_LATCH.3 | v49.02,38.1 49.02,33.36 SOLID_LATCH.3 44.12,36.36 C16.2 | C17.2 39.04,35.99 37.59,34.54 34.46,34.54 R19.1 | C24.2 25.07,35.38 v25.65,34.8 | U1.14 24.55,36.3 C24.2 | CATCHER_LATCH.3 29.21,33.49 v29.21,33.78 | C27.1 13.04,41.06 v12.7,41.4 | WEIGHT_SENSOR.2 51.37,57.09 v53.09,55.37 | SERVO3.3 7.87,18.38 v7.87,19.3
  other vias: 10.16,51.82 11.18,51.82 12.19,51.82 13.21,51.82 14.22,51.82 14.22,50.8 13.21,50.8 12.19,50.8 11.18,50.8 11.18,49.78 11.18,48.77 11.18,47.75 11.18,46.74 10.16,46.74 10.16,47.75 10.16,48.77 10.16,49.78 9.14,48.77 9.14,47.75 9.14,46.74 12.19,48.77 12.19,49.78 13.21,49.78 14.22,49.78 14.22,48.77 13.21,48.77 13.21,47.75 12.19,47.75 12.19,46.74 14.22,47.75 10.16,50.8 1.78,32.26 2.79,32.26 3.81,32.26 4.83,32.26 4.83,31.24 3.81,31.24 2.79,31.24 1.78,31.24 7.87,21.34 8.89,21.34 9.91,21.34 9.91,20.32 8.89,20.32 8.89,19.3 9.91,19.3 28.19,21.34 29.21,21.34 30.23,21.34 30.23,20.32 29.21,20.32 28.19,20.32 28.19,19.3 29.21,19.3 30.23,19.3 44.7,21.34 44.7,20.32 44.7,19.3 45.72,19.3 46.74,19.3 46.74,20.32 46.74,21.34 45.72,21.34 45.72,20.32 63.5,20.32 63.5,21.34 64.52,21.34 64.52,20.32 64.52,19.3 63.5,19.3 62.48,19.3 62.48,20.32 62.48,21.34 81.03,19.81 82.04,19.81 82.04,18.8 81.03,18.8 80.01,18.8 80.01,19.81 80.01,20.83 16.26,8.38 17.02,8.38 17.02,7.37 16.26,7.37 16.26,6.35 17.02,6.35 35.31,8.38 36.07,8.38 36.07,7.37 35.31,7.37 36.07,6.35 35.31,6.35 39.12,8.38 39.12,9.14 39.12,7.62 54.36,6.1 55.12,6.1 72.39,45.72 73.15,45.72 73.15,44.7 72.39,44.7 72.39,43.69 73.15,43.69 65.02,45.72 65.02,44.7 65.02,43.69 22.86,32.26 23.88,32.26 24.89,32.26 25.91,32.26 25.91,31.24 24.89,31.24 23.88,31.24 22.86,31.24 50.8,48.26 50.8,47.24 49.78,47.24 49.78,48.26 49.78,49.28 50.8,49.28 67.06,48.01 67.06,49.02 67.06,50.29 67.06,51.31 40.64,42.96
  pour GND: 0,66.04 0,0 90.17,0 90.17,66.04
  cutout GND: 2.29,64.77 2.29,58.67 2.29,58.42 20.32,58.42 20.57,58.42 20.57,64.77
  pour Bottom: 1.02,32.51 1.02,28.7 1.52,28.19 5.84,28.19 6.1,28.45 6.1,32.51
GPIO0  (1 unrouted)
LRSW  (1 unrouted)
N$1  (1 unrouted)
N$2  (3 unrouted)
N$3  (1 unrouted)
N$4  (1 unrouted)
N$5  (1 unrouted)
N$6  (2 unrouted)
N$7  (4 unrouted)
N$8  (2 unrouted)
N$9  (2 unrouted)
N$10  (3 unrouted)
N$11  (2 unrouted)
N$12  (1 unrouted)
N$13  (1 unrouted)
N$14  (1 unrouted)
N$15  (3 unrouted)
N$16  (2 unrouted)
N$17  (2 unrouted)
N$18  (3 unrouted)
N$19  (1 unrouted)
N$20  (2 unrouted)
N$21  (1 unrouted)
N$22  (3 unrouted)
N$23  (2 unrouted)
N$24  (2 unrouted)
N$25  (3 unrouted)
N$26  (2 unrouted)
N$27  (1 unrouted)
N$28  (2 unrouted)
N$33  (1 unrouted)
N$34  (2 unrouted)
N$35  (1 unrouted)
N$36  (1 unrouted)
N$37  (1 unrouted)
N$38  (1 unrouted)
N$39  (1 unrouted)
N$40  (1 unrouted)
N$41  (1 unrouted)
N$42  (1 unrouted)
N$43  (1 unrouted)
N$44  (1 unrouted)
N$45  (1 unrouted)
N$46  (via drill 0.35)
  Top 0.203: v20.62,30.18 18.73,28.3 18.73,11.37 17.27,9.91 v13.46,9.91
  Bottom 0.203: U1.10 21.95,31.51 v20.62,30.18 | R79.2 13.21,10.16 v13.46,9.91
N$47  (via drill 0.35)
  Top 0.203: v19.81,30.73 18.32,29.25 18.32,18.58 v16.51,16.76
  Bottom 0.203: U1.9 21.3,32.22 v19.81,30.73 | R80.2 13.97,13.97 16.51,16.51 v16.51,16.76
N$48  (via drill 0.35)
  Top 0.203: v20.07,32 20.07,33.55 17.41,36.21 12.59,36.21 v12.19,35.81
  Bottom 0.203: R81.2 11.43,36.58 v12.19,35.81 | U1.8 20.64,32.58 v20.07,32
N$49  (via drill 0.35)
  Top 0.203: v20.9,34.8 20.62,35.08 20.62,37.19 15.24,42.57 15.24,43.43 14.48,44.2 v11.94,44.2
  Bottom 0.203: U1.7 20,33.89 v20.9,34.8 | R82.2 11.94,45.05 v11.94,44.2
N$50  (1 unrouted)
N$51  (1 unrouted)
N$52  (1 unrouted)
N$53  (1 unrouted)
N$54
  Top 0.203: U$9.B_R 21.9,62.25 U$9.T_R 25.78,61 R13.1
N$55  (1 unrouted)
OA1_1
  Top 0.381: STEPPER1.1 80.23,11.99 80.03,12.19 80.03,15.77 80.53,16.26 IC1.24
OA1_2
  Top 0.381: STEPPER2.1 61.31,9.81 61.07,10.04 61.07,14.59 63,16.52 IC2.24
OA1_3
  Top 0.381: STEPPER3.1 42.26,12.61 42.68,13.04 42.68,13.98 45.22,16.52 IC3.24
OA1_4
  Top 0.381: STEPPER4.1 23.21,10.07 26.17,13.04 26.17,14.74 27.12,15.69 27.66,15.69 27.96,15.99 27.96,16.28 28.71,17.03 IC4.24
OA1_5
  Top 0.381: STEPPER5.1 4.16,9.49 6.1,11.43 6.1,15.49 7.37,16.76 8.13,16.76 8.39,17.03 IC5.24
OA2_1  (via drill 0.38)
  Top 0.381: STEPPER1.2 82.23,10.61 v81.53,11.31 | IC1.21 78.74,18.1 v78.74,17.53
  Bottom 0.381: v81.53,11.31 80.95,11.89 80.95,14.28 78.74,16.5 v78.74,17.53
OA2_2  (via drill 0.38)
  Top 0.381: STEPPER2.2 63.31,10.61 v63.25,10.67 | IC2.21 61,18.07 v60.96,18.03
  Bottom 0.381: v63.25,10.67 63.25,15.75 v60.96,18.03
OA2_3  (via drill 0.38)  (1 unrouted)
  Top 0.381: STEPPER3.2 44.26,9.21 v44.7,9.65 | v43.18,17.78 43.18,18.71 43.22,18.75
  Bottom 0.381: v44.7,9.65 44.7,16.26 v43.18,17.78
OA2_4  (via drill 0.38)
  Top 0.381: STEPPER4.2 25.21,9.84 v25.15,9.91 | IC4.21 26.69,18.8 v25.4,18.8
  Bottom 0.381: v25.15,9.91 25.15,16.26 24.5,16.91 24.5,17.89 v25.4,18.8
OA2_5  (via drill 0.51)  (1 unrouted)
  Top 0.381: STEPPER5.2 6.16,10.22 v6.23,10.29 | v6.27,18.03 6.39,18.16 6.39,18.75
  Bottom 0.381: v6.23,10.29 6.23,18 v6.27,18.03
OB1_1
  Top 0.381: STEPPER1.3 83.47,8.66 83.47,14.81 82.26,16.02 81.78,16.02 81.53,16.26 IC1.26
OB1_2
  Top 0.381: STEPPER2.3 65.31,15.43 64.75,15.99 64.75,16.43 64,17.18 IC2.26
OB1_3  (via drill 0.38)
  Top 0.381: STEPPER3.3 46.26,9.88 v46.23,9.91 | IC3.26 v46.23,16.76
  Bottom 0.381: v46.23,9.91 v46.23,16.76
OB1_4  (via drill 0.38)
  Top 0.381: STEPPER4.3 27.21,9.37 v26.42,10.16 | IC4.26 v29.72,16.22
  Bottom 0.381: v26.42,10.16 26.42,12.92 v29.72,16.22
OB1_5
  Top 0.381: STEPPER5.3 8.16,10.13 6.86,11.43 6.86,15.1 7.77,16.02 8.39,16.02 9.39,17.01 IC5.26
OB2_1  (via drill 0.38)
  Top 0.381: STEPPER1.4 86.23,9.78 v85.85,10.16 | IC1.1 83.57,18.27 v83.57,17.53
  Bottom 0.381: v85.85,10.16 85.85,12.35 85.75,12.46 85.75,15.35 v83.57,17.53
OB2_2  (via drill 0.38)  (1 unrouted)
  Top 0.381: STEPPER2.4 67.31,9.65 v67.56,9.91 | v66.04,18.03 66,18.07 66,18.75
  Bottom 0.381: v67.56,9.91 66.98,10.49 66.98,13.01 66.04,13.96 v66.04,18.03
OB2_3  (via drill 0.38)
  Top 0.381: STEPPER3.4 v48.26,9.9 v48.26,9.91 | IC3.1 48.26,18.78 v48.26,18.03
  Bottom 0.381: v48.26,9.91 v48.26,18.03
OB2_4  (via drill 0.38)  (1 unrouted)
  Top 0.381: STEPPER4.4 29.21,9.97 v29.46,10.23 | v31.75,18.03 31.75,18.71 31.71,18.75
  Bottom 0.381: v29.46,10.23 30.8,11.57 30.8,13.01 31.75,13.96 v31.75,18.03
OB2_5  (via drill 0.51)  (1 unrouted)
  Top 0.381: STEPPER5.4 10.16,10.66 11.06,11.56 11.06,14.87 v11.43,15.24
  Top 0.508: v11.43,18.03 11.39,18.07 11.39,18.68
  Bottom 0.508: v11.43,15.24 v11.43,18.03
OE
  Bottom 0.203: U1.23 19.54,27.37 19.54,26.94 20.57,25.9 R4.1
ONBOARD_LED  (1 unrouted)
PDN_UART_1
  Top 0.203: R32.2 86.07,25.61 85.88,25.61 84.66,24.38 80.52,24.38 79.53,23.39 IC1.14
PDN_UART_2
  Top 0.203: R39.2 62.73,25.14 61.98,24.38 61.98,22.84 IC2.14
PDN_UART_3  (1 unrouted)
PDN_UART_4  (1 unrouted)
PDN_UART_5  (1 unrouted)
PWM1
  Bottom 0.762: SERVO1.1 8.28,50.44 6.86,49.02 6.86,46.48 8.13,45.21 R82.1
PWM2
  Bottom 0.762: SERVO2.1 11.01,39.37 R81.1
PWM3
  Bottom 0.762: R80.1 SERVO3.1
PWM4
  Bottom 0.508: SERVO4.1 8.99,8.38 9.65,8.38 10.48,9.21 R79.1
PWM5
  Bottom 0.762: R78.1 SERVO5.1
PWM6
  Bottom 0.762: R77.1 SERVO6.1
PWM7
  Bottom 0.762: R76.1 SERVO7.1
PWM8
  Bottom 0.762: R75.1 SERVO8.1
PWM9
  Bottom 0.762: R74.1 SEROVO9.1
PWM10
  Bottom 0.762: R73.1 SERVO10.1
PWM11
  Bottom 0.762: R72.1 80.13,11.73 80.13,11.26 81.23,10.16 SERVO11.1
PWM12
  Bottom 0.762: R71.1 81.7,22.86 SERVO12.1
PWM13
  Bottom 0.762: LIQUID_LATCH.1 R83.1
PWM14
  Bottom 0.762: R84.1 SOLID_LATCH.1
PWM15
  Bottom 0.762: CATCHER_LATCH.1 34.48,32.6 R85.1
RESET  (2 unrouted)
RTS  (2 unrouted)
RXD0  (1 unrouted)
SCL  (4 unrouted)
  Bottom 0.152: U1.26 17.39,24.52 18.92,22.99 R8.1
SDA  (4 unrouted)
  Bottom 0.152: R6.1 16.75,22.71 U1.27
SRSW  (1 unrouted)
TRI_5V_1  (2 unrouted)
TRI_5V_2
  Top 0.203: IC2.8 65.27,23.09 C39.2 67.81,25.4 R37.2
TRI_5V_3  (1 unrouted)
  Top 0.203: C46.2 45.71,24.64 46.74,24.64 47.22,24.15 IC3.8
TRI_5V_4  (2 unrouted)
TRI_5V_5  (2 unrouted)
TXD0  (1 unrouted)
VBUS  (2 unrouted)
VCC  (via drill 0.51)  (38 unrouted)
  Top 0.508: R13.2 31.08,58.51 v31.24,58.67 | X-HOMING-SW.1 32.75,35.07 v30.99,36.83 | Y-HOMING-SW.1 32.75,39.65 v31.85,38.76
  pour Vref: -0.25,65.79 -0.25,34.8 57.4,34.8 62.99,40.39 71.37,48.77 71.37,65.79
  cutout Vref: 2.29,64.77 2.29,58.42 20.57,58.42 20.57,64.77
VCP  (1 unrouted)
VCP1  (1 unrouted)
VCP2  (1 unrouted)
VCP3  (1 unrouted)
VCP4  (1 unrouted)
VDD  (2 unrouted)
VIB_5V  (2 unrouted)
VREF  (1 unrouted)
  Top 0.203: R29.2 76.2,21.08 76.96,20.33 78.18,20.33
VREF1
  Top 0.203: R29.1 75,22.17 74.17,21.34 74.17,20.07 74.41,19.82 R30.1
VREF2
  Top 0.203: IC2.17 60.03,20.82 R36.2
VREF3  (1 unrouted)
VREF4
  Top 0.203: R43.2 42.25,20.82 IC3.17
VREF5
  Top 0.203: R43.1 39.44,21.52 40.14,20.82 R44.1
VREF6
  Top 0.203: R50.2 25.74,20.82 IC4.17
VREF7
  Top 0.203: R50.1 22.93,22.02 R51.1
VREF8
  Top 0.203: R57.2 5.42,20.82 IC5.17
VREF9
  Top 0.203: R57.1 2.61,20.89 R58.1
X-HOMING  (1 unrouted)
Y-HOMING  (1 unrouted)